# Altium schematic sheet Microcontroller.SchDoc
size 406 x 304 mm; SheetNumber: 9; SheetTotal: 10
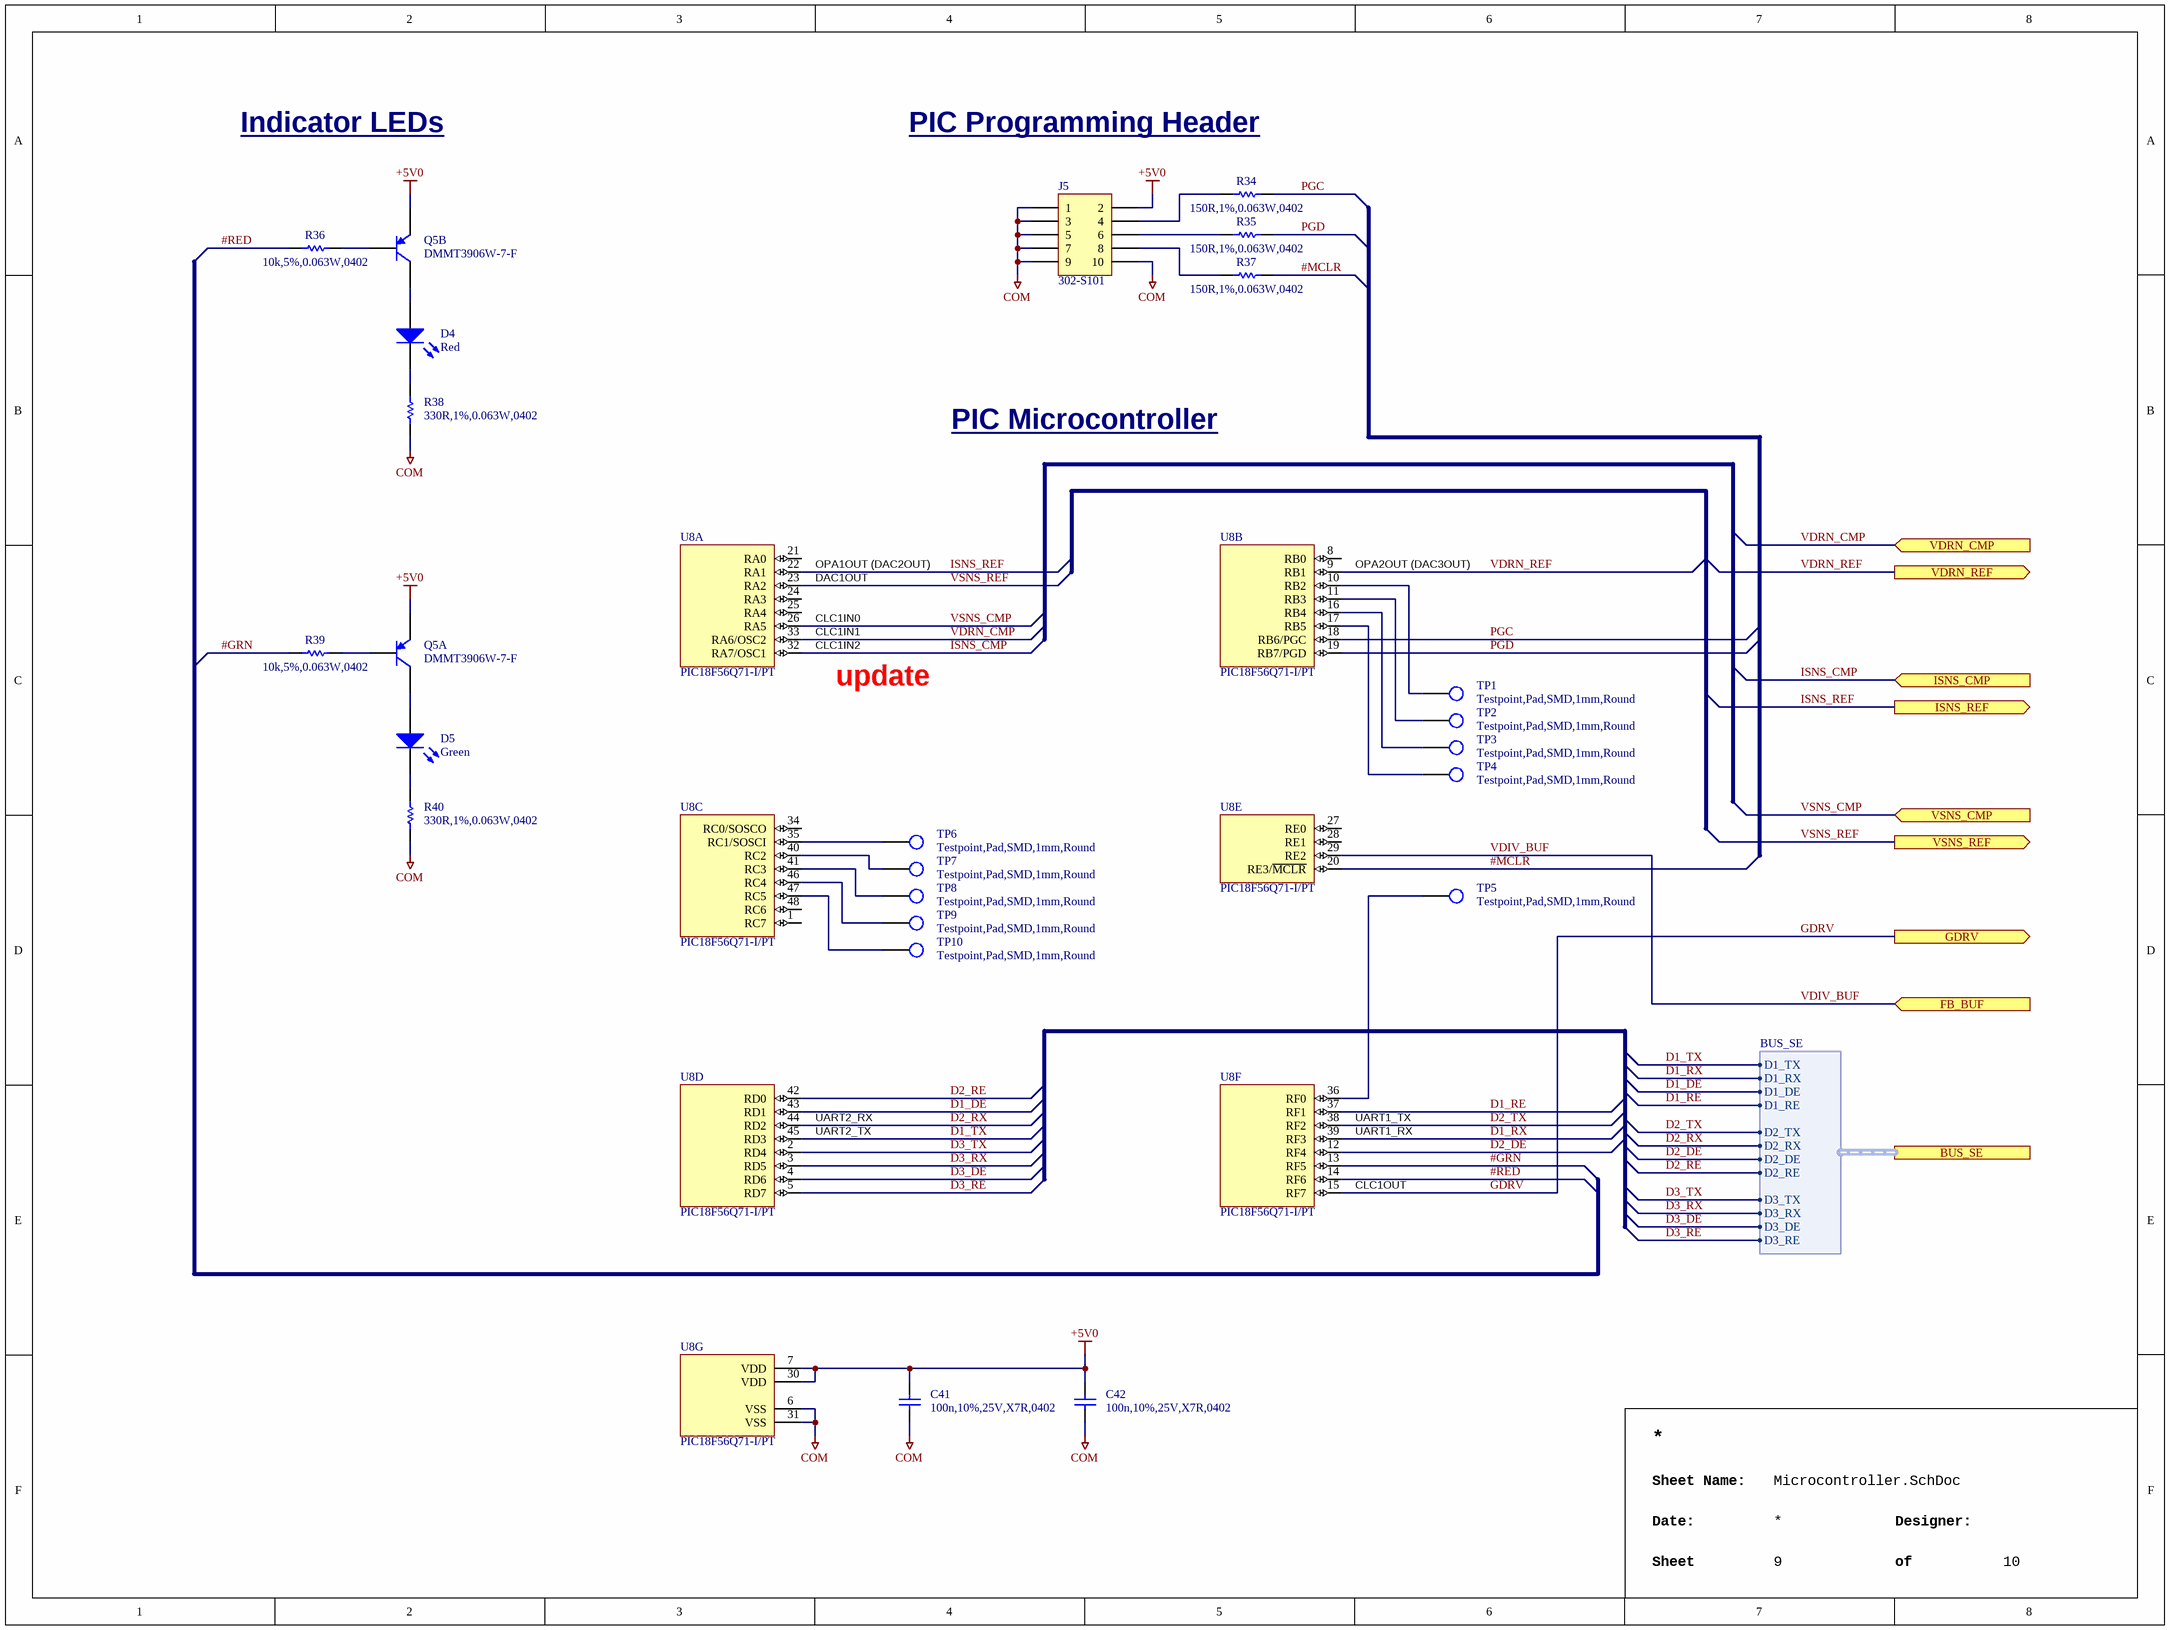
[diagram p0: Microcontroller.SchDoc]

## Parts
C41  100n,10%,25V,X7R,0402  [CAPC1005X06N]
C42  100n,10%,25V,X7R,0402  [CAPC1005X06N]
D4  Red  [LITE-ON_LTST-C190KRKT]
D5  Green  [LITE-ON_LTST-C190KGKT]
J5  302-S101  [ONSHORE_302-S101]
Q5  DMMT3906W-7-F  [DIODES_SOT363]  (parts A,B of 2)
R34  150R,1%,0.063W,0402  [RESC1005X04N]
R35  150R,1%,0.063W,0402  [RESC1005X04N]
R36  10k,5%,0.063W,0402  [RESC1005X04N]
R37  150R,1%,0.063W,0402  [RESC1005X04N]
R38  330R,1%,0.063W,0402  [RESC1005X04N]
R39  10k,5%,0.063W,0402  [RESC1005X04N]
R40  330R,1%,0.063W,0402  [RESC1005X04N]
TP1  Testpoint,Pad,SMD,1mm,Round  [TP100]
TP2  Testpoint,Pad,SMD,1mm,Round  [TP100]
TP3  Testpoint,Pad,SMD,1mm,Round  [TP100]
TP4  Testpoint,Pad,SMD,1mm,Round  [TP100]
TP5  Testpoint,Pad,SMD,1mm,Round  [TP100]
TP6  Testpoint,Pad,SMD,1mm,Round  [TP100]
TP7  Testpoint,Pad,SMD,1mm,Round  [TP100]
TP8  Testpoint,Pad,SMD,1mm,Round  [TP100]
TP9  Testpoint,Pad,SMD,1mm,Round  [TP100]
TP10  Testpoint,Pad,SMD,1mm,Round  [TP100]
U8  PIC18F56Q71-I/PT  [TSQFP50P900X900X120-48N]  (parts A,B,C,D,E,F,G of 7)

## Ports
BUS_SE (harness BUS_SE), FB_BUF (in), GDRV (out), ISNS_CMP (in), ISNS_REF (out), VDRN_CMP (in), VDRN_REF (out), VSNS_CMP (in), VSNS_REF (out)

## Harnesses
BUS_SE: D1_RX, D1_DE, D1_RE, D1_TX, D3_RX, D3_RE, D3_DE, D3_TX, D2_RX, D2_DE, D2_RE, D2_TX

## Nets
+5V0: C41.2 C42.2 J5.2 Q5.4(E1) Q5.5(E2) U8.7(VDD) U8.30(VDD)
COM: C41.1 C42.1 J5.1 J5.3 J5.5 J5.7 J5.9 J5.10 R38.1 R40.1 U8.6(VSS) U8.31(VSS)
#GRN: R39.2 U8.13(RF5)
#MCLR: R37.2 U8.20(RE3/~{MCLR})
#RED: R36.2 U8.14(RF6)
D1_DE: U8.43(RD1) ; port BUS_SE.D1_DE
D1_RE: U8.37(RF1) ; port BUS_SE.D1_RE
D1_RX: U8.39(RF3) ; port BUS_SE.D1_RX
D1_TX: U8.45(RD3) ; port BUS_SE.D1_TX
D2_DE: U8.12(RF4) ; port BUS_SE.D2_DE
D2_RE: U8.42(RD0) ; port BUS_SE.D2_RE
D2_RX: U8.44(RD2) ; port BUS_SE.D2_RX
D2_TX: U8.38(RF2) ; port BUS_SE.D2_TX
D3_DE: U8.4(RD6) ; port BUS_SE.D3_DE
D3_RE: U8.5(RD7) ; port BUS_SE.D3_RE
D3_RX: U8.3(RD5) ; port BUS_SE.D3_RX
D3_TX: U8.2(RD4) ; port BUS_SE.D3_TX
GDRV: U8.15(RF7) ; port GDRV
ISNS_CMP: U8.32(RA7/OSC1) ; port ISNS_CMP
ISNS_REF: U8.22(RA1) ; port ISNS_REF
PGC: R34.2 U8.18(RB6/PGC)
PGD: R35.2 U8.19(RB7/PGD)
VDIV_BUF: U8.29(RE2) ; port FB_BUF
VDRN_CMP: U8.33(RA6/OSC2) ; port VDRN_CMP
VDRN_REF: U8.9(RB1) ; port VDRN_REF
VSNS_CMP: U8.26(RA5) ; port VSNS_CMP
VSNS_REF: U8.23(RA2) ; port VSNS_REF
NetD4_A: D4.A Q5.6(C2)
NetD4_C: D4.C R38.2
NetD5_A: D5.A Q5.3(C1)
NetD5_C: D5.C R40.2
NetJ5_4: J5.4 R34.1
NetJ5_6: J5.6 R35.1
NetJ5_8: J5.8 R37.1
NetQ5_1: Q5.1(B2) R36.1
NetQ5_2: Q5.2(B1) R39.1
NetTP1_1: TP1.1(TP) U8.10(RB2)
NetTP2_1: TP2.1(TP) U8.11(RB3)
NetTP3_1: TP3.1(TP) U8.16(RB4)
NetTP4_1: TP4.1(TP) U8.17(RB5)
NetTP5_1: TP5.1(TP) U8.36(RF0)
NetTP6_1: TP6.1(TP) U8.35(RC1/SOSCI)
NetTP7_1: TP7.1(TP) U8.40(RC2)
NetTP8_1: TP8.1(TP) U8.41(RC3)
NetTP9_1: TP9.1(TP) U8.46(RC4)
NetTP10_1: TP10.1(TP) U8.47(RC5)

Not connected (* = marked no-connect by the designer): U8 1(RC7) 8(RB0) 21(RA0) 24(RA3) 25(RA4) 27(RE0) 28(RE1) 34(RC0/SOSCO) 48(RC6)

## Notes on the sheet
- Indicator LEDs
- PIC Programming Header
- PIC Microcontroller
- (near U8) OPA1OUT (DAC2OUT)
- (near U8) OPA2OUT (DAC3OUT)
- (near U8) DAC1OUT
- (near U8) CLC1IN0
- (near U8) CLC1IN1
- (near U8) CLC1IN2
- update
- (near U8) UART2_TX
- (near U8) UART2_RX
- (near U8) UART1_TX
- (near U8) UART1_RX
- (near U8) CLC1OUT
- Sheet Name:
- Date:
- Sheet
- Designer:
- of

## Library data of the parts
C41 C42 = CAP,Cer,100nF,10%,25V,X7R,0402: 0.1ï¿½F ï¿½10% 25V Ceramic Capacitor X7R 0402 (1005 Metric); Manufacturer 1: Murata Electronics; Manufacturer 1 Part Number: GRM155R71E104KE14J; Vendor 1 Part Number: 490-14603-1-ND; Vendor 1: DigiKey; Value: 100nF; Part Name: CAP,Cer,100nF,10%,25V,X7R,0402; CreatedBy: Judd Foster; HelpURL: https://search.murata.co.jp/Ceramy/image/img/A01X/G101/ENG/GRM155R71E104KE14-01.pdf
D4 = LED,Red,SMD,0603: Red 631nm LED Indication - Discrete 2V 0603 (1608 Metric); Manufacturer 1: Lite-On Inc.; Manufacturer 1 Part Number: LTST-C190KRKT; Vendor 1 Part Number: 160-1436-1-ND; Vendor 1: Digikey; Part Name: LED,Red,SMD,0603; CreatedBy: Judd Foster; HelpURL: https://optoelectronics.liteon.com/upload/download/DS-22-99-0151/LTST-C190KRKT.pdf; Value: Red
D5 = LED,Green,SMD,0603: Green 571nm LED Indication - Discrete 2V 0603 (1608 Metric); Manufacturer 1: Lite-On Inc.; Manufacturer 1 Part Number: LTST-C190KGKT; Vendor 1 Part Number: 160-1435-1-ND; Vendor 1: Digikey; Part Name: LED,Green,SMD,0603; CreatedBy: Judd Foster; HelpURL: https://optoelectronics.liteon.com/upload/download/DS22-2000-074/LTST-C190KGKT.PDF; Value: Green
J5 = Term,Header,5x2 Pin,2.54mm,Thru: Connector Header Through Hole 10 position 0.100" (2.54mm); Manufacturer 1: On Shore Technology Inc.; Vendor 1 Part Number: ED1543-ND; Vendor 1: Digikey; Part Name: Term,Header,5x2 Pin,2.54mm,Thru; CreatedBy: Judd Foster; HelpURL: https://mm.digikey.com/Volume0/opasdata/d220001/medias/docus/6025/302-S.pdf; Manufacturer 1 Part Number: 302-S101
Q5 = Trans,PNP,Dual,40V,200mA,SOT363: Bipolar (BJT) Transistor Array 2 PNP (Dual) Matched Pair 40V 200mA 250MHz 200mW Surface Mount SOT-363; Manufacturer 1: Diodes Incorporated; Vendor 1 Part Number: DMMT3906W-FDICT-ND; Vendor 1: Digikey; Part Name: Trans,PNP,Dual,40V,200mA,SOT363; CreatedBy: Judd Foster; HelpURL: https://www.diodes.com/assets/Datasheets/ds30312.pdf; Manufacturer 1 Part Number: DMMT3906W-7-F
R34 R35 R37 = RES,150R,1%,0.1W,0402: 150 Ohms ï¿½1% 0.063W, 1/16W Chip Resistor 0402 (1005 Metric) Automotive AEC-Q200, Moisture Resistant Thick Film; Manufacturer 1: TE Connectivity Passive Product; Manufacturer 1 Part Number: CRGCQ0402F150R; Vendor 1 Part Number: A129617CT-ND; Vendor 1: Digikey; Part Name: RES,150R,1%,0.1W,0402; CreatedBy: Judd Foster; HelpURL: https://www.te.com/commerce/DocumentDelivery/DDEController?Action=srchrtrv&DocNm=1773204-3&DocType=DS&DocLang=English; Value: 150R
R36 R39 = RES,10k,5%,0.063W,0402: 10 kOhms ï¿½5% 0.063W, 1/16W Chip Resistor 0402 (1005 Metric) Automotive AEC-Q200 Thick Film; Manufacturer 1: Stackpole Electronics Inc; Manufacturer 1 Part Number: RMCF0402JT10K0; Vendor 1 Part Number: RMCF0402JT10K0CT-ND; Vendor 1: DIgikey; Part Name: RES,10k,5%,0.063W,0402; CreatedBy: Judd Foster; HelpURL: https://www.seielect.com/catalog/sei-rmcf_rmcp.pdf; Value: 10k
R38 R40 = RES,330R,1%,0.063W,0402: 330 Ohms Â±1% 0.063W, 1/16W Chip Resistor 0402 (1005 Metric) Moisture Resistant Thick Film; Manufacturer 1: YAGEO; Manufacturer 1 Part Number: RC0402FR-07330RL; Vendor 1 Part Number: 311-330LRCT-ND; Vendor 1: DigiKey; Part Name: RES,330R,1%,0.063W,0402; CreatedBy: Judd Foster; HelpURL: https://www.yageo.com/upload/media/product/products/datasheet/rchip/PYu-RC_Group_51_RoHS_L_12.pdf; Value: 330R
TP1-TP10 = Testpoint,Pad,SMD: PCB Testpoint 1mm Round; Part Name: Testpoint,Pad,SMD; CreatedBy: Judd Foster; HelpURL: N/A; Manufacturer 1: N/A; Manufacturer 1 Part Number: N/A; Vendor 1: N/A; Vendor 1 Part Number: N/A
U8 = PIC18F56Q71-I/PT: PIC PICï¿½ 18F Microcontroller IC 8-Bit 64MHz 64KB (64K x 8) FLASH 48-TQFP (7x7); Manufacturer 1: Microchip Technology; Vendor 1 Part Number: 150-PIC18F56Q71-I/PT-ND; Vendor 1: Digikey; Part Name: PIC18F56Q71-I/PT; CreatedBy: Judd Foster; HelpURL: https://ww1.microchip.com/downloads/aemDocuments/documents/MCU08/ProductDocuments/DataSheets/PIC18F26-46-56Q71-Microcontroller-Data-Sheet-DS40002329.pdf; Manufacturer 1 Part Number: PIC18F56Q71-I/PT